# EAGLE schematic io_board (EAGLE 6.5.0)
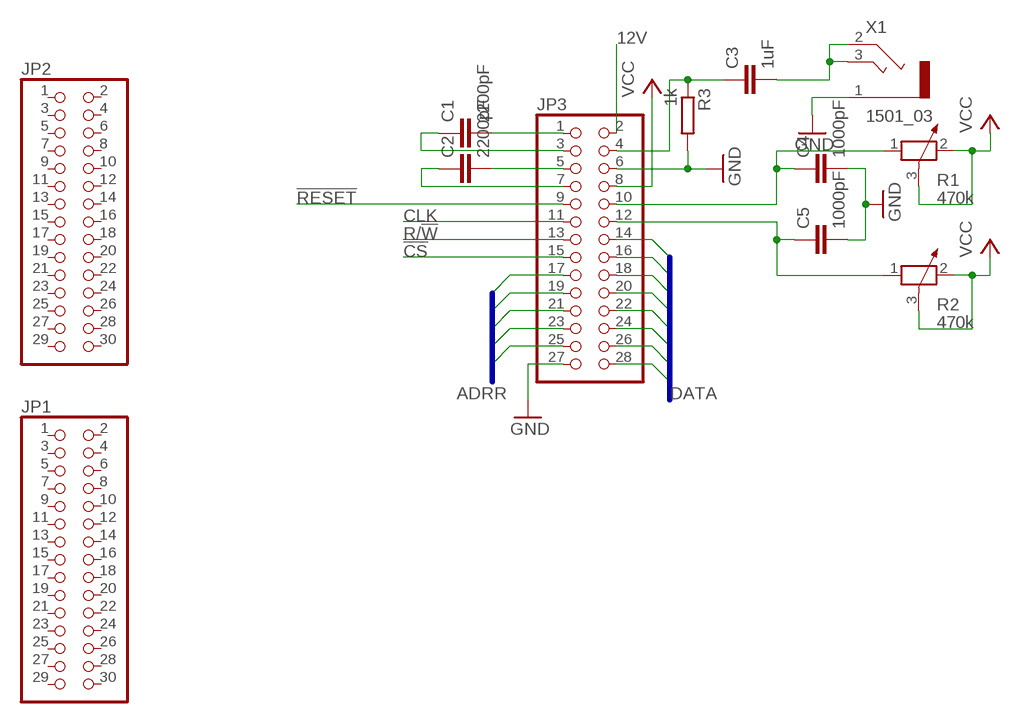
[diagram p0: schematic, sheet 1]

## Parts
C1  2200pF  C-EUC1206  [C1206]
C2  2200pF  C-EUC1206  [C1206]
C3  1uF  C-EUC1206  [C1206]
C4  1000pF  C-EUC1206  [C1206]
C5  1000pF  C-EUC1206  [C1206]
JP1  PINHD-2X15  [2X15]
JP2  PINHD-2X15  [2X15]
JP3  PINHD-2X14  [2X14]
R1  470k  POTENTIOMETER_PT-10  [PT-10]
R2  470k  POTENTIOMETER_PT-10  [PT-10]
R3  1k  R-EU_R0805  [R0805]
X1  1501_03  [1501_03]

## Nets
12V: JP3.2
!CS: JP3.15
!RESET: JP3.9
CLK: JP3.11
GND: C4.2 C5.2 JP3.6 JP3.27 R3.2 X1.1
N$1: JP3.16
N$2: JP3.18
N$3: JP3.20
N$4: JP3.22
N$5: JP3.24
N$6: JP3.26
N$7: JP3.28
N$8: JP3.14
N$9: C4.1 JP3.10 R1.1
N$10: JP3.25
N$11: C1.2 JP3.1
N$12: C1.1 JP3.3
N$13: C5.1 JP3.12 R2.1
N$14: C2.2 JP3.5
N$15: C2.1 JP3.7
N$16: JP3.23
N$17: JP3.21
N$18: JP3.19
N$19: JP3.17
N$20: C3.2 X1.2 X1.3
N$21: C3.1 JP3.4 R3.1
R/!W: JP3.13
VCC: JP3.8 R1.2 R1.3 R2.2 R2.3
Unconnected: JP1.1 JP1.2 JP1.3 JP1.4 JP1.5 JP1.6 JP1.7 JP1.8 JP1.9 JP1.10 JP1.11 JP1.12 JP1.13 JP1.14 JP1.15 JP1.16 JP1.17 JP1.18 JP1.19 JP1.20 JP1.21 JP1.22 JP1.23 JP1.24 JP1.25 JP1.26 JP1.27 JP1.28 JP1.29 JP1.30 JP2.1 JP2.2 JP2.3 JP2.4 JP2.5 JP2.6 JP2.7 JP2.8 JP2.9 JP2.10 JP2.11 JP2.12 JP2.13 JP2.14 JP2.15 JP2.16 JP2.17 JP2.18 JP2.19 JP2.20 JP2.21 JP2.22 JP2.23 JP2.24 JP2.25 JP2.26 JP2.27 JP2.28 JP2.29 JP2.30

## Buses
DATA
ADRR

## Library data of the parts
C1-C5 = rcl:C-EU: CAPACITOR, European symbol
JP1 JP2 = pinhead:PINHD-2X15: PIN HEADER
JP3 = pinhead:PINHD-2X14: PIN HEADER
R1 R2 = rcl:POTENTIOMETER_: Potentiometer
R3 = rcl:R-EU_: RESISTOR, European symbol
X1 = con-lumberg:1501_03: Klinkensteckverbinder nach JISC 6560, 2,5 mm Jack connectors according to JISC 6560, 2.5 mm Source: http://www.lumberg.com/Produkte/PDFs/1501_03.pdf; OC_FARNELL: 1200127; OC_NEWARK: unknown